# EasyEDA schematic Smart Environment Schematic.json
TITLE: Sheet_1; REV: 1.0; Date: 2024-01-31; Sheet: 1/1; Drawn By: AKSHAY; Company: NCAIR
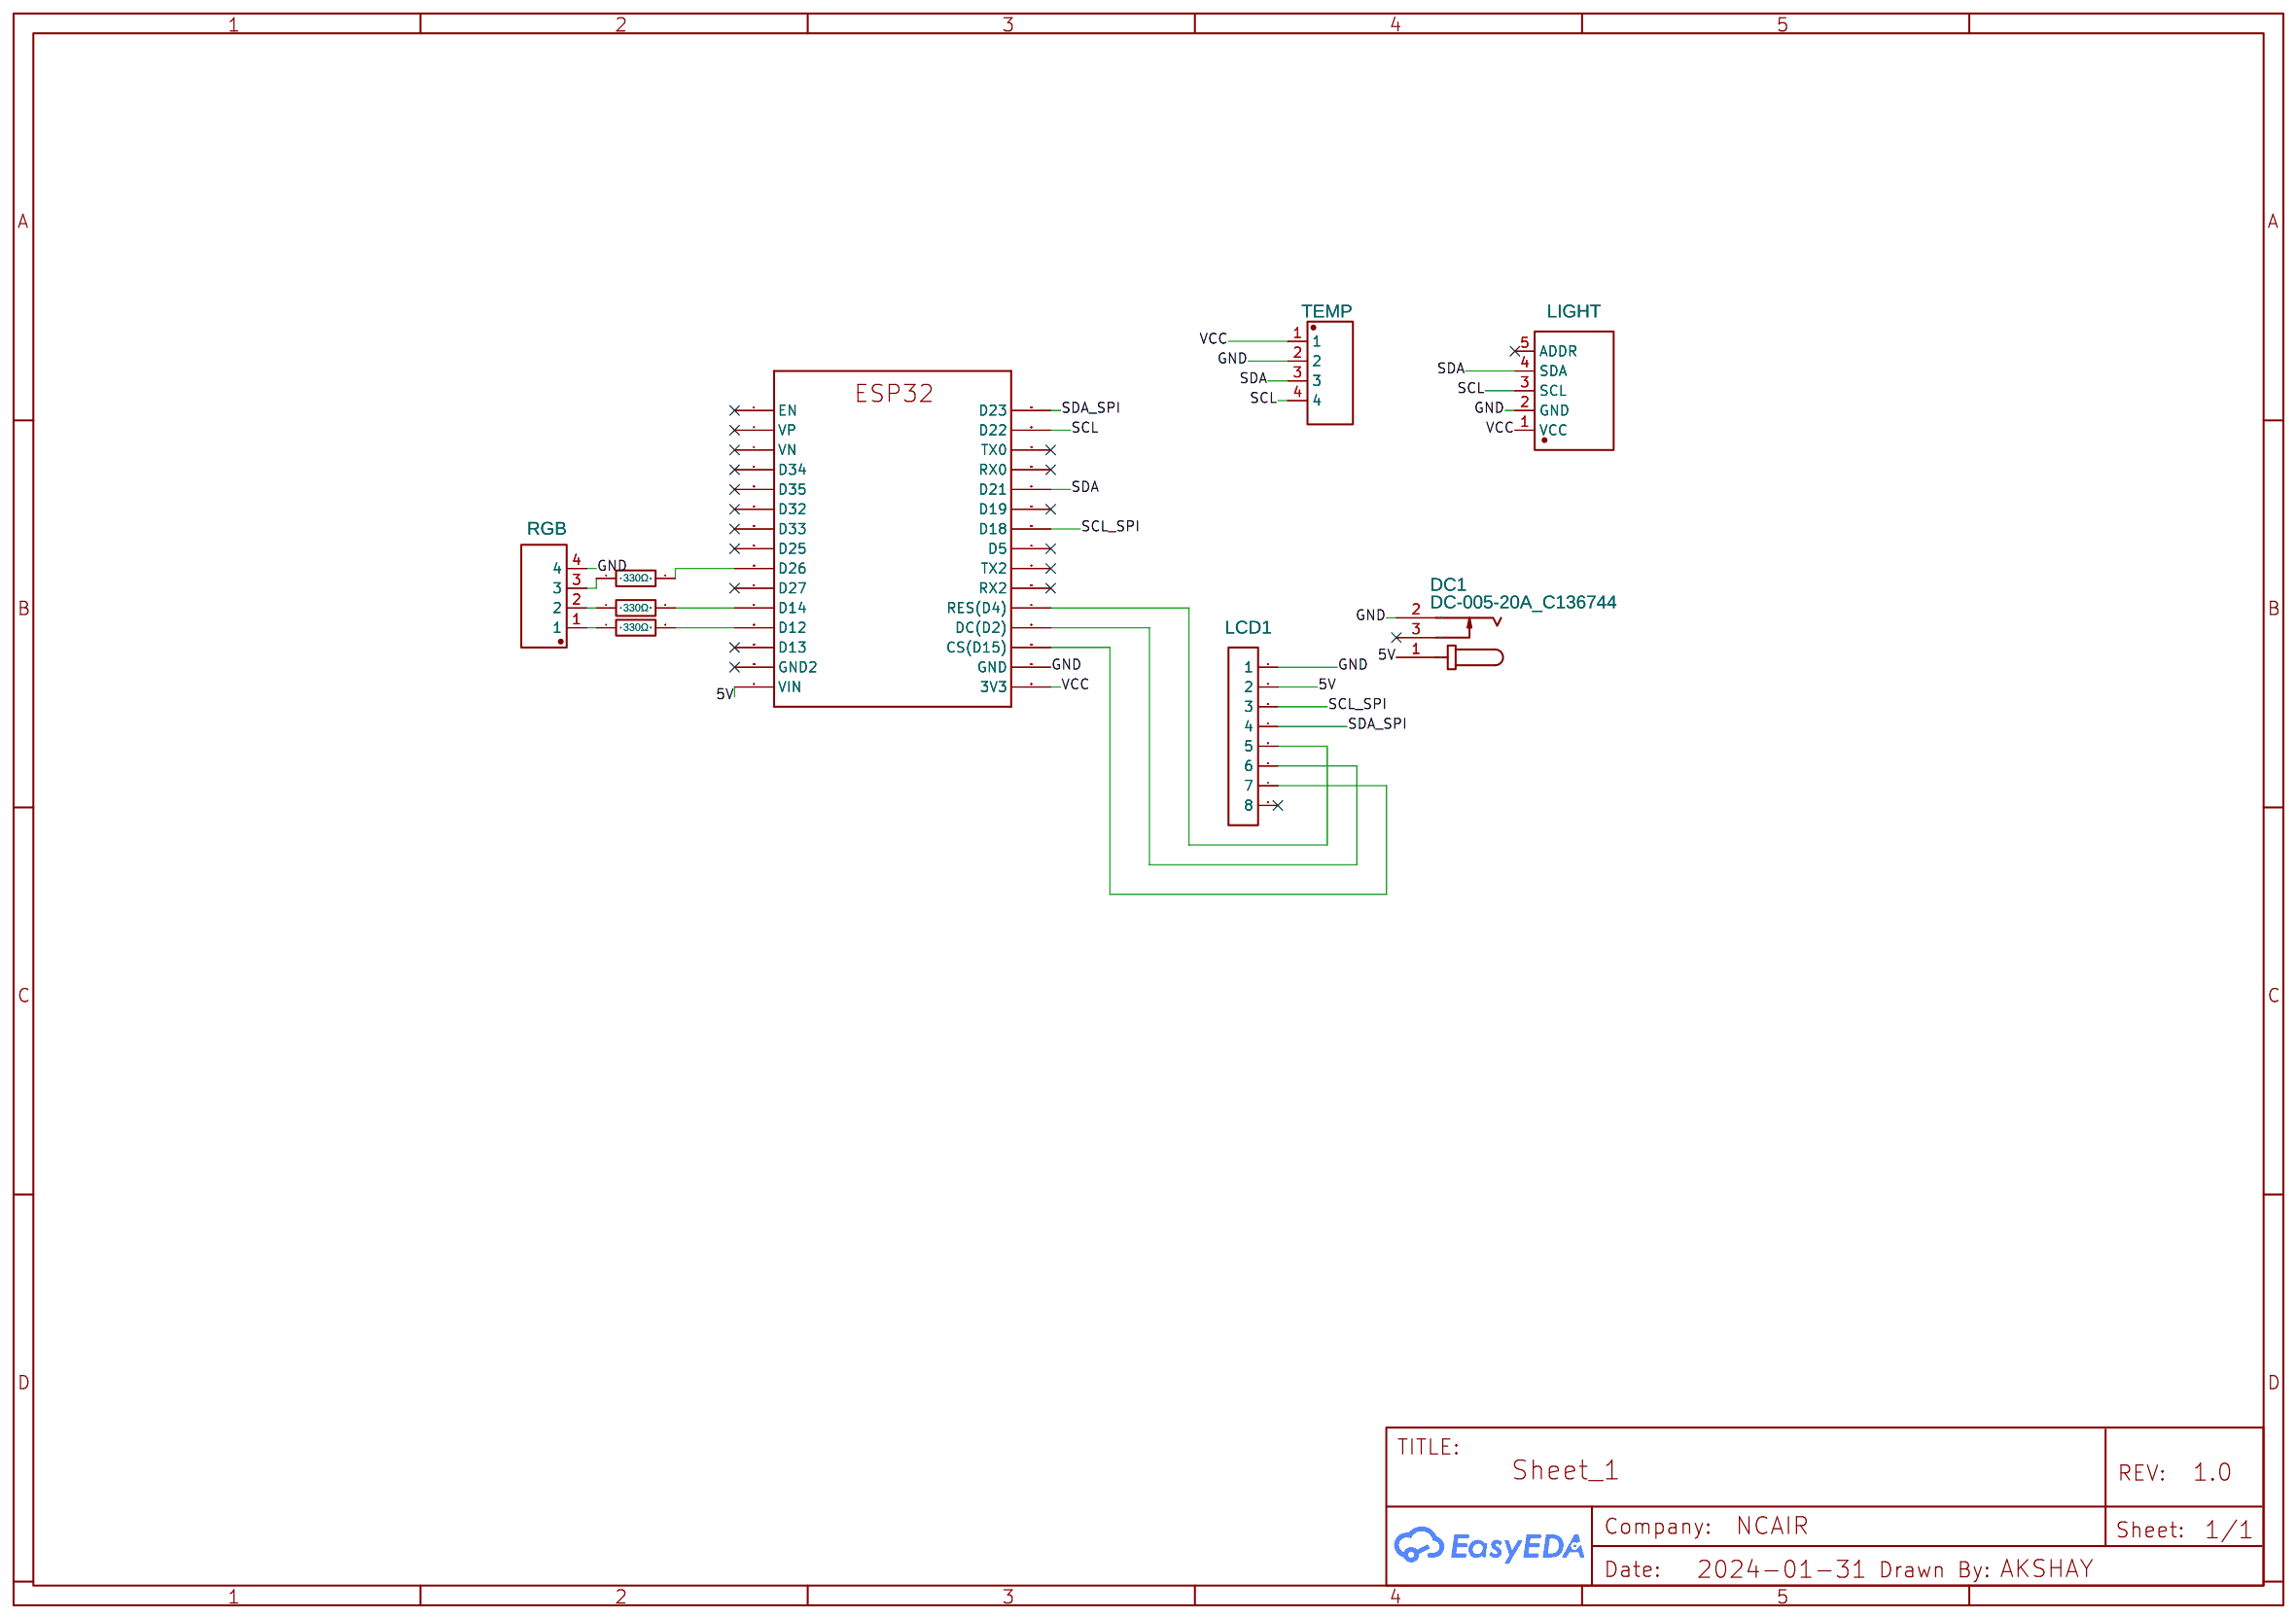
[diagram p0: schematic sheet]

## Parts
1  ESP32  [ESP32-DEVKITV1_ESP32-DEVKITV1]
DC1  DC-005-20A_C136744  [DC-IN-TH_DC-005-20A]
LCD1  PINHEADER-8PIN  [PINHEADER-8PIN]
LIGHT  IR  [MY_BH1750]
R1  330Ω  [AXIAL-0.4]
R2  330Ω  [AXIAL-0.4]
R3  330Ω  [AXIAL-0.4]
RGB1  RGB  [HEADER - HEADER-FEMALE-2.54_1X4]
SHT3X  TEMP  [HEADER - HEADER-FEMALE-2.54_1X4]

## Library data of the parts
1 = ESP32-DEVKIT-V1-30PIN: Contributor: fredwyl
DC1 = DC-005-20A_C136744: Contributor: LCSC; Supplier: LCSC; Manufacturer: 韩国韩荣; Manufacturer Part: DC-005-20A; Supplier Part: C136744; JLCPCB Part Class: Extended Part
LCD1 = PINHEADER-8PIN: Contributor: DAIVIK DAVE
LIGHT = My_BH1750: Contributor: MykolaSa; Package Display: No
R1-R3 = 330 ohm resistor: Supplier: LCSC; Manufacturer: UniOhm; Manufacturer Part: MFR0W4F3300A50; Supplier Part: C58608; Contributor: tunahanbayrak; Package Display: No
RGB1 SHT3X = HEADER-2.54_1X4: Contributor: amazingmj; Package Display: No

## Nets
5V: 1.VIN DC1.1 LCD1.2
GND: 1.GND DC1.2 LCD1.1 LIGHT.2(GND) RGB1.4 SHT3X.2
VCC: 1.3V3 LIGHT.1(VCC) SHT3X.1
SCL: 1.D22 LIGHT.3(SCL) SHT3X.4
SCL_SPI: 1.D18 LCD1.3
SDA: 1.D21 LIGHT.4(SDA) SHT3X.3
SDA_SPI: 1.D23 LCD1.4
Net-(1-D2): 1.D2(DC(D2)) LCD1.6
Net-(1-D4): 1.D4(RES(D4)) LCD1.5
Net-(1-D12): 1.D12 R3.2
Net-(1-D14): 1.D14 R2.2
Net-(1-D15): 1.D15(CS(D15)) LCD1.7
Net-(1-D26): 1.D26 R1.2
Net-(R1-1): R1.1 RGB1.3
Net-(R2-1): R2.1 RGB1.2
Net-(R3-1): R3.1 RGB1.1

Not connected (* = marked no-connect by the designer): 1 D5* D13* D19* D25* D27* D32* D33* D34* D35* EN* GND2* RX0* RX2* TX0* TX2* VN* VP*; DC1 3*; LCD1 8*; LIGHT 5(ADDR)*
